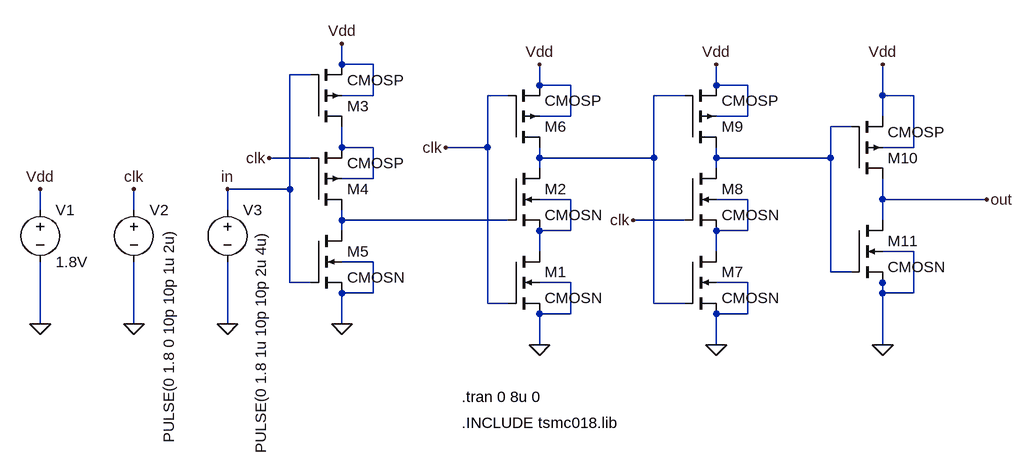
[diagram p0: schematic tspcDff.asc]
tspcDff.asc, the LTspice schematic file:
Version 4
SHEET 1 1948 680
WIRE 752 -96 752 -128
WIRE 800 -96 752 -96
WIRE 704 -80 672 -80
WIRE 1056 -64 1056 -96
WIRE 1104 -64 1056 -64
WIRE 1328 -64 1328 -96
WIRE 1376 -64 1328 -64
WIRE 800 -48 800 -96
WIRE 800 -48 752 -48
WIRE 1008 -48 976 -48
WIRE 1280 -48 1232 -48
WIRE 1584 -48 1584 -96
WIRE 1632 -48 1584 -48
WIRE 1104 -16 1104 -64
WIRE 1104 -16 1056 -16
WIRE 1376 -16 1376 -64
WIRE 1376 -16 1328 -16
WIRE 1584 -16 1584 -48
WIRE 1536 0 1504 0
WIRE 752 32 752 0
WIRE 800 32 752 32
WIRE 976 32 976 -48
WIRE 976 32 912 32
WIRE 1632 32 1632 -48
WIRE 1632 32 1584 32
WIRE 704 48 640 48
WIRE 1056 48 1056 32
WIRE 1232 48 1232 -48
WIRE 1232 48 1056 48
WIRE 1328 48 1328 32
WIRE 1504 48 1504 0
WIRE 1504 48 1328 48
WIRE 1056 64 1056 48
WIRE 1328 64 1328 48
WIRE 800 80 800 32
WIRE 800 80 752 80
WIRE 672 96 672 -80
WIRE 672 96 576 96
WIRE 1104 112 1056 112
WIRE 1376 112 1328 112
WIRE 1584 112 1584 80
WIRE 1744 112 1584 112
WIRE 288 128 288 96
WIRE 432 128 432 96
WIRE 576 128 576 96
WIRE 752 144 752 128
WIRE 1008 144 752 144
WIRE 1280 144 1200 144
WIRE 1584 144 1584 112
WIRE 752 160 752 144
WIRE 1104 160 1104 112
WIRE 1104 160 1056 160
WIRE 1376 160 1376 112
WIRE 1376 160 1328 160
WIRE 1056 192 1056 160
WIRE 1328 192 1328 160
WIRE 1632 192 1584 192
WIRE 800 208 752 208
WIRE 1504 224 1504 48
WIRE 1536 224 1504 224
WIRE 672 240 672 96
WIRE 704 240 672 240
WIRE 1104 240 1056 240
WIRE 1376 240 1328 240
WIRE 1584 240 1584 224
WIRE 800 256 800 208
WIRE 800 256 752 256
WIRE 1584 256 1584 240
WIRE 1632 256 1632 192
WIRE 1632 256 1584 256
WIRE 976 272 976 32
WIRE 1008 272 976 272
WIRE 1232 272 1232 48
WIRE 1280 272 1232 272
WIRE 1104 288 1104 240
WIRE 1104 288 1056 288
WIRE 1376 288 1376 240
WIRE 1376 288 1328 288
WIRE 288 304 288 208
WIRE 432 304 432 208
WIRE 576 304 576 208
WIRE 752 304 752 256
WIRE 1056 336 1056 288
WIRE 1328 336 1328 288
WIRE 1584 336 1584 256
FLAG 432 304 0
FLAG 752 304 0
FLAG 1056 336 0
FLAG 1328 336 0
FLAG 752 -128 Vdd
FLAG 1056 -96 Vdd
FLAG 1328 -96 Vdd
FLAG 912 32 clk
FLAG 1200 144 clk
FLAG 640 48 clk
FLAG 576 304 0
FLAG 576 96 in
FLAG 288 304 0
FLAG 288 96 Vdd
FLAG 432 96 clk
FLAG 1744 112 out
FLAG 1584 -96 Vdd
FLAG 1584 336 0
SYMBOL voltage 432 112 R0
WINDOW 3 54 45 VRight 2
WINDOW 123 0 0 Left 0
WINDOW 39 0 0 Left 0
SYMATTR Value PULSE(0 1.8 0 10p 10p 1u 2u)
SYMATTR InstName V2
SYMBOL voltage 576 112 R0
WINDOW 3 51 47 VRight 2
WINDOW 123 0 0 Left 0
WINDOW 39 0 0 Left 0
SYMATTR Value PULSE(0 1.8 1u 10p 10p 2u 4u)
SYMATTR InstName V3
SYMBOL voltage 288 112 R0
WINDOW 123 0 0 Left 0
WINDOW 39 0 0 Left 0
SYMATTR InstName V1
SYMATTR Value 1.8V
SYMBOL cmosn 1008 192 R0
SYMATTR InstName M1
SYMATTR Value2 l=180n w=180n
SYMBOL cmosn 1008 64 R0
SYMATTR InstName M2
SYMATTR Value2 l=180n w=180n
SYMBOL cmosp 1008 32 M180
SYMATTR InstName M6
SYMATTR Value2 l=180n w=180n
SYMBOL cmosp 704 0 M180
SYMATTR InstName M3
SYMATTR Value2 l=180n w=180n
SYMBOL cmosp 704 128 M180
SYMATTR InstName M4
SYMATTR Value2 l=450n w=180n
SYMBOL cmosn 704 160 R0
SYMATTR InstName M5
SYMATTR Value2 l=180n w=180n
SYMBOL cmosn 1280 192 R0
SYMATTR InstName M7
SYMATTR Value2 l=180n w=180n
SYMBOL cmosn 1280 64 R0
SYMATTR InstName M8
SYMATTR Value2 l=180n w=180n
SYMBOL cmosp 1280 32 M180
SYMATTR InstName M9
SYMATTR Value2 l=180n w=180n
SYMBOL cmosp 1536 80 M180
SYMATTR InstName M10
SYMATTR Value2 l=450n w=180n
SYMBOL cmosn 1536 144 R0
SYMATTR InstName M11
SYMATTR Value2 l=180n w=180n
TEXT 936 416 Left 2 !.tran 0 8u 0
TEXT 936 456 Left 2 !.INCLUDE tsmc018.lib

The netlist it stands for:
* tspcDff.asc
V2 clk 0 PULSE(0 1.8 0 10p 10p 1u 2u)
V3 in 0 PULSE(0 1.8 1u 10p 10p 2u 4u)
V1 Vdd 0 1.8V
M1 N004 clk 0 0 CMOSN l=180n w=180n
M2 N001 N006 N004 N004 CMOSN l=180n w=180n
M6 N001 clk Vdd Vdd CMOSP l=180n w=180n
M3 N003 in Vdd Vdd CMOSP l=180n w=180n
M4 N006 clk N003 N003 CMOSP l=450n w=180n
M5 N006 in 0 0 CMOSN l=180n w=180n
M7 N005 N001 0 0 CMOSN l=180n w=180n
M8 N002 clk N005 N005 CMOSN l=180n w=180n
M9 N002 N001 Vdd Vdd CMOSP l=180n w=180n
M10 out N002 Vdd Vdd CMOSP l=450n w=180n
M11 out N002 0 0 CMOSN l=180n w=180n
.model NMOS NMOS
.model PMOS PMOS
.lib standard.mos
.tran 0 8u 0
.INCLUDE tsmc018.lib
.backanno
.end